# Altium project IStoreMedicinv1.PrjPcb
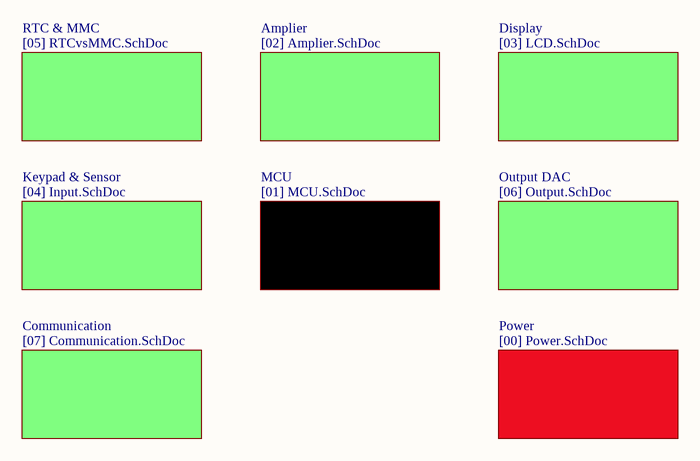
[diagram p0: IStoreMedicinv1.SchDoc]
9 sheets, 202 parts. Net scope: global (net labels, ports and power ports of the same name join across sheets).
Board file: IStoreMedicinv1.PcbDoc
Sheets:
  IStoreMedicinv1.SchDoc
    MCU = [01] MCU.SchDoc
    Amplier = [02] Amplier.SchDoc
    Display = [03] LCD.SchDoc
    Keypad & Sensor = [04] Input.SchDoc
    RTC & MMC = [05] RTCvsMMC.SchDoc
    Output DAC = [06] Output.SchDoc
    Communication = [07] Communication.SchDoc
    Power = [00] Power.SchDoc

## Sheet IStoreMedicinv1.SchDoc
size A

### Sub-sheets
Amplier = [02] Amplier.SchDoc: no entries
Communication = [07] Communication.SchDoc: no entries
Display = [03] LCD.SchDoc: no entries
Keypad & Sensor = [04] Input.SchDoc: no entries
MCU = [01] MCU.SchDoc: no entries
Output DAC = [06] Output.SchDoc: no entries
Power = [00] Power.SchDoc: no entries
RTC & MMC = [05] RTCvsMMC.SchDoc: no entries

## Sheet [01] MCU.SchDoc
size A3
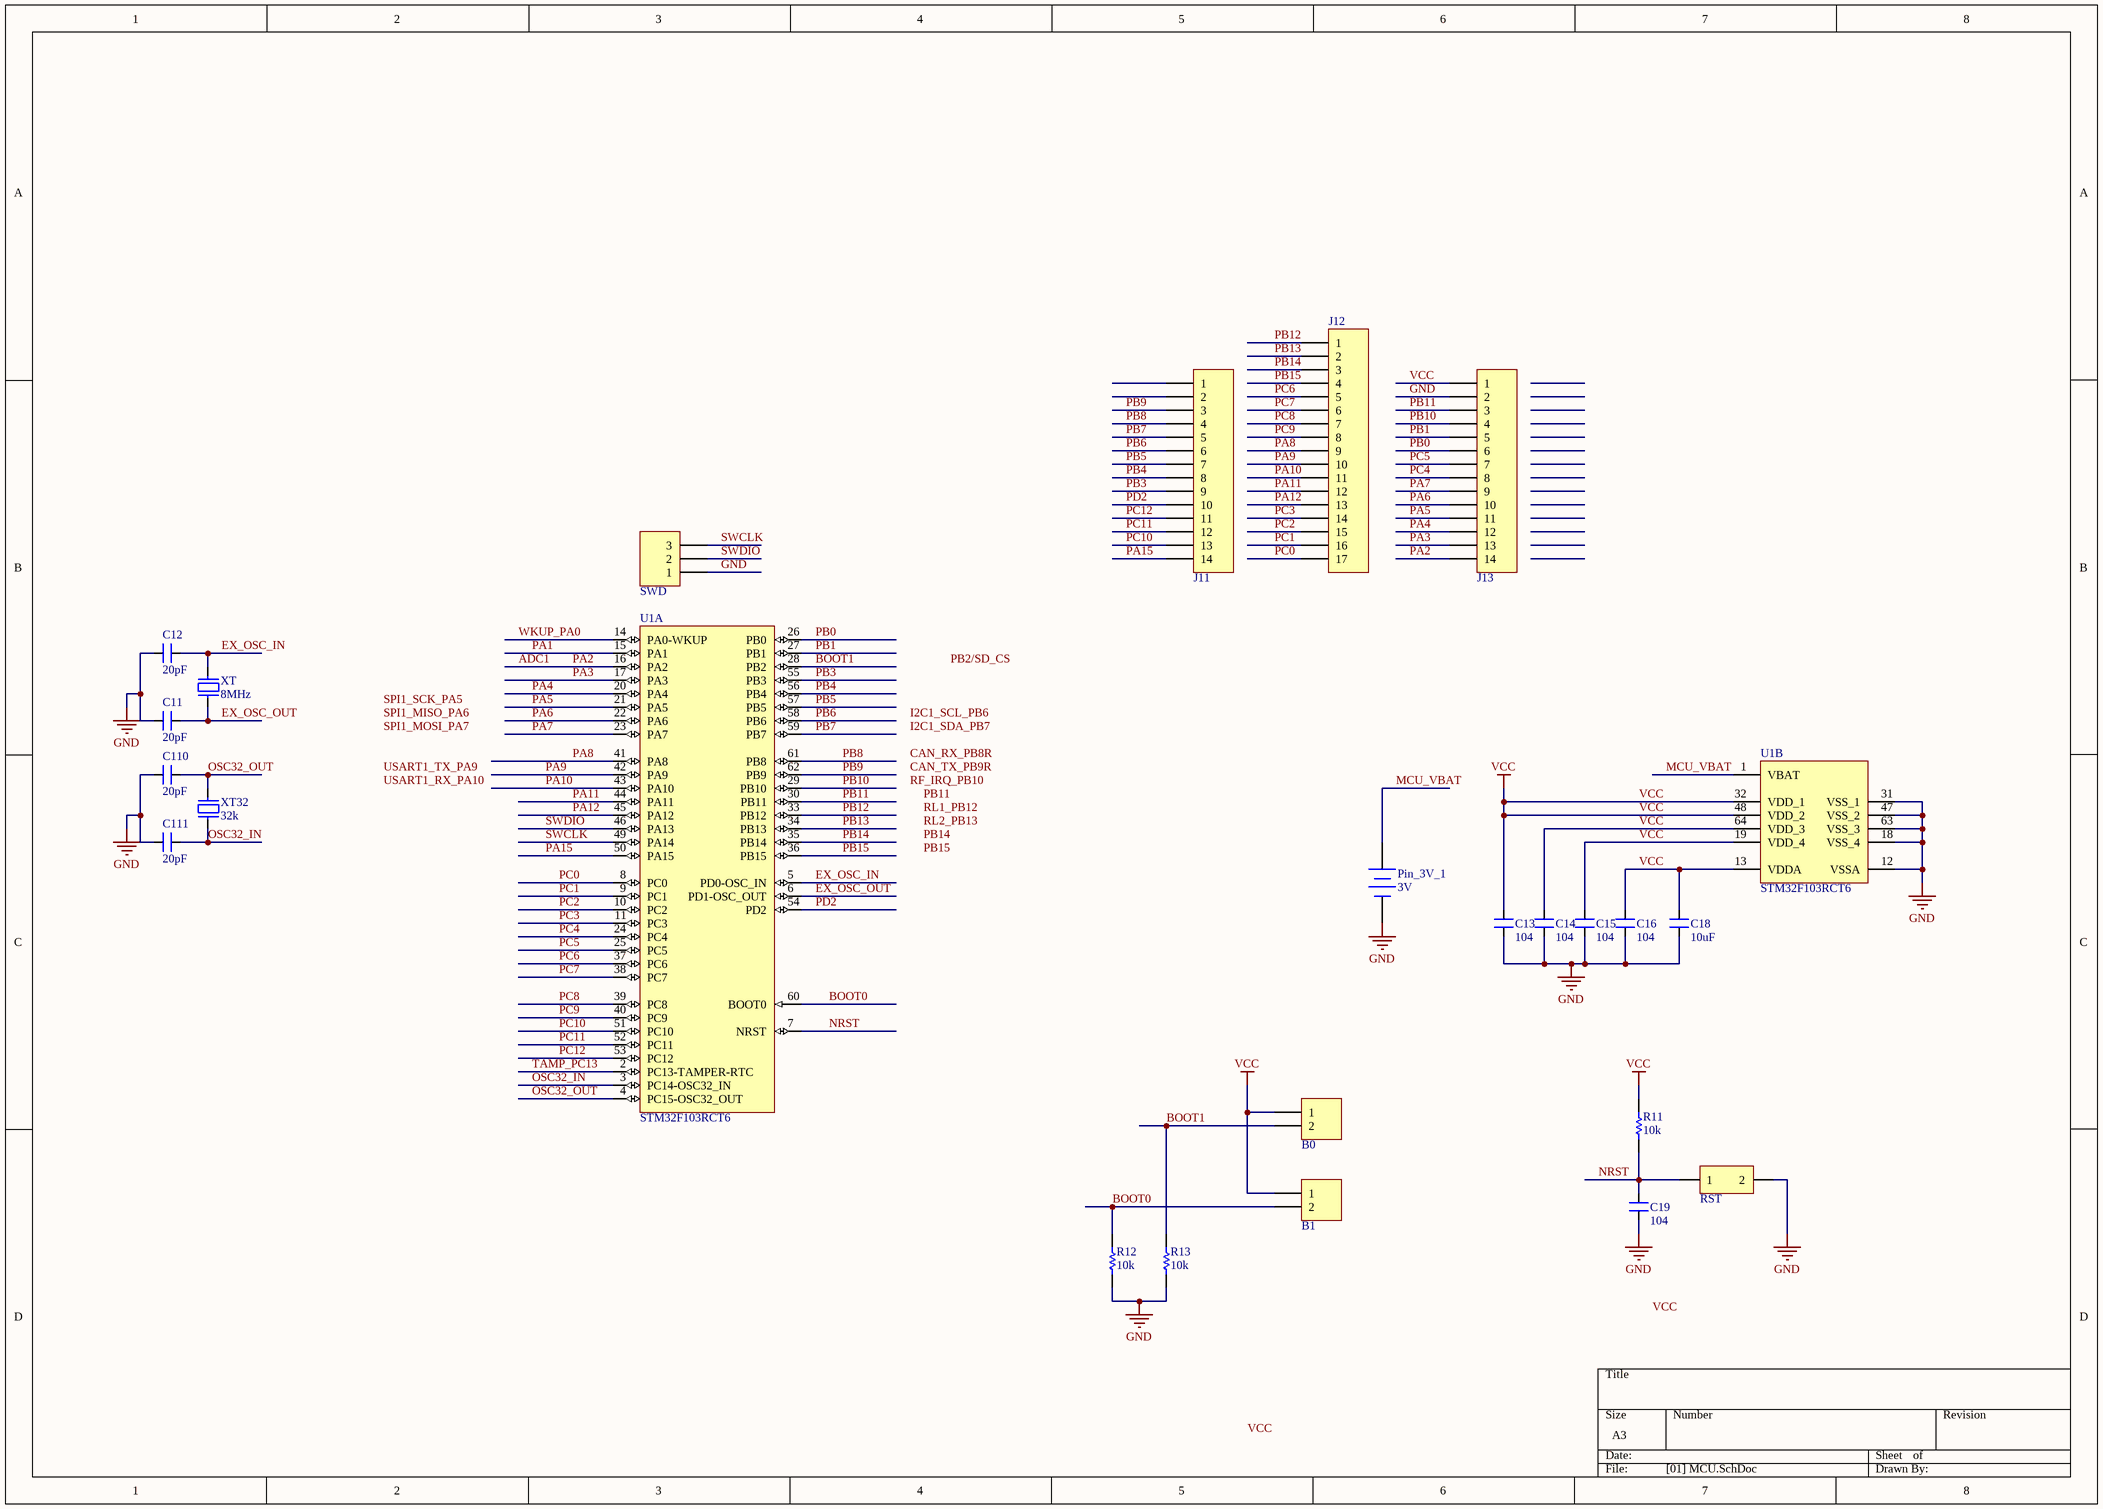
[diagram p1: [01] MCU.SchDoc]

### Parts
B0  Header 2  [HDR1X2]  (value not drawn)
B1  Header 2  [HDR1X2]  (value not drawn)
C11  value 20pF  [CAPC1608N]  (hidden comment: Cap_22p_0603)
C12  value 20pF  [CAPC1608N]  (hidden comment: Cap_22p_0603)
C13  value 104  [CAPC1608N]  (hidden comment: Cap_104_0603)
C14  value 104  [CAPC1608N]  (hidden comment: Cap_104_0603)
C15  value 104  [CAPC1608N]  (hidden comment: Cap_104_0603)
C16  value 104  [CAPC1608N]  (hidden comment: Cap_104_0603)
C18  value 10uF  [CAPC2012N_F]  (hidden comment: Cap_10uF_0805)
C19  value 104  [CAPC1608N]  (hidden comment: Cap_104_0603)
C110  value 20pF  [CAPC1608N]  (hidden comment: Cap_22p_0603)
C111  value 20pF  [CAPC1608N]  (hidden comment: Cap_22p_0603)
J11  Header 14  [HDR1X14]  (value not drawn)
J12  Header 17  [HDR1X17]  (value not drawn)
J13  Header 14  [HDR1X14]  (value not drawn)
Pin_3V_1  3V  [CR1220]
R11  value 10k  [RESC1608N_F]  (hidden comment: Res_10k_0603)
R12  value 10k  [RESC1608N_F]  (hidden comment: Res_10k_0603)
R13  value 10k  [RESC1608N_F]  (hidden comment: Res_10k_0603)
RST  Button  [SW]  (value not drawn)
SWD  Header 3  [HDR1X3]  (value not drawn)
U1  STM32F103RCT6  [STM-LQFP64_N]  (parts A,B of 2)
XT  8MHz  [XT2]
XT32  32k  [XTminiv2]

### Nets
GND: C11.2 C12.2 C13.1 C14.1 C15.1 C16.1 C18.1 C19.1 C110.2 C111.2 J13.2 Pin_3V_1.2(-) R12.1 R13.1 RST.2 SWD.1 U1.12(VSSA) U1.18(VSS_4) U1.31(VSS_1) U1.47(VSS_2) U1.63(VSS_3)
VCC: B0.1 B1.1 C13.2 C14.2 C15.2 C16.2 C18.2 J13.1 R11.2 U1.13(VDDA) U1.19(VDD_4) U1.32(VDD_1) U1.48(VDD_2) U1.64(VDD_3)
ADC1: J13.14 U1.16(PA2)  [also labelled PA2]
BOOT0: B1.2 R12.2 U1.60(BOOT0)
BOOT1: B0.2 R13.2 U1.28(PB2)
EX_OSC_IN: C12.1 U1.5(PD0-OSC_IN) XT.2
EX_OSC_OUT: C11.1 U1.6(PD1-OSC_OUT) XT.1
MCU_VBAT: Pin_3V_1.1(+) U1.1(VBAT)
NRST: C19.2 R11.1 RST.1 U1.7(NRST)
OSC32_IN: C111.1 U1.3(PC14-OSC32_IN) XT32.1
OSC32_OUT: C110.1 U1.4(PC15-OSC32_OUT) XT32.2
PA1: U1.15(PA1)
PA3: J13.13 U1.17(PA3)
PA4: J13.12 U1.20(PA4)
PA5: J13.11 U1.21(PA5)
PA6: J13.10 U1.22(PA6)
PA7: J13.9 U1.23(PA7)
PA8: J12.9 U1.41(PA8)
PA9: J12.10 U1.42(PA9)
PA10: J12.11 U1.43(PA10)
PA11: J12.12 U1.44(PA11)
PA12: J12.13 U1.45(PA12)
PA15: J11.14 U1.50(PA15)
PB0: J13.6 U1.26(PB0)
PB1: J13.5 U1.27(PB1)
PB3: J11.9 U1.55(PB3)
PB4: J11.8 U1.56(PB4)
PB5: J11.7 U1.57(PB5)
PB6: J11.6 U1.58(PB6)
PB7: J11.5 U1.59(PB7)
PB8: J11.4 U1.61(PB8)
PB9: J11.3 U1.62(PB9)
PB10: J13.4 U1.29(PB10)
PB11: J13.3 U1.30(PB11)
PB12: J12.1 U1.33(PB12)
PB13: J12.2 U1.34(PB13)
PB14: J12.3 U1.35(PB14)
PB15: J12.4 U1.36(PB15)
PC0: J12.17 U1.8(PC0)
PC1: J12.16 U1.9(PC1)
PC2: J12.15 U1.10(PC2)
PC3: J12.14 U1.11(PC3)
PC4: J13.8 U1.24(PC4)
PC5: J13.7 U1.25(PC5)
PC6: J12.5 U1.37(PC6)
PC7: J12.6 U1.38(PC7)
PC8: J12.7 U1.39(PC8)
PC9: J12.8 U1.40(PC9)
PC10: J11.13 U1.51(PC10)
PC11: J11.12 U1.52(PC11)
PC12: J11.11 U1.53(PC12)
PD2: J11.10 U1.54(PD2)
SWCLK: SWD.3 U1.49(PA14)
SWDIO: SWD.2 U1.46(PA13)
TAMP_PC13: U1.2(PC13-TAMPER-RTC)
WKUP_PA0: U1.14(PA0-WKUP)

Not connected (* = marked no-connect by the designer): J11 1 2

### Notes on the sheet
- Labels drawn without touching a wire or pin: CAN_RX_PB8R, CAN_TX_PB9R, I2C1_SCL_PB6, I2C1_SDA_PB7, PB2/SD_CS, PB11, PB14, PB15, RF_IRQ_PB10, RL1_PB12, RL2_PB13, SPI1_MISO_PA6, SPI1_MOSI_PA7, SPI1_SCK_PA5, USART1_RX_PA10, USART1_TX_PA9, VCC

### Library data of the parts
B0 B1 = Header 2: Header, 2-Pin; LatestRevisionDate: 17-Jul-2002; LatestRevisionNote: Re-released for DXP Platform.; Publisher: Altium Limited
C11-C16 C18 C19 C110 C111 = CAP NP
J11 J13 = Header 14: Header, 14-Pin; LatestRevisionDate: 17-Jul-2002; LatestRevisionNote: Re-released for DXP Platform.; Publisher: Altium Limited
J12 = Header 17: Header, 17-Pin; LatestRevisionDate: 17-Jul-2002; LatestRevisionNote: Re-released for DXP Platform.; Publisher: Altium Limited
Pin_3V_1 = Battery: Multicell Battery; Published: 24-Mar-1999; LatestRevisionDate: 17-Jul-2002; LatestRevisionNote: Re-released for DXP Platform.; PackageReference: BAT-2; Publisher: Altium Limited
R11-R13 = Res
RST = Button I
SWD = Header 3: Header, 3-Pin; LatestRevisionDate: 17-Jul-2002; LatestRevisionNote: Re-released for DXP Platform.; Publisher: Altium Limited
U1 = STM32F103RCT6: ARM Cortex-M3 32-bit MCU, 256 KB Flash, 48 KB Internal RAM, 51 I/Os, 64-pin LQFP, -40 to 85 degC, Tray; A/D Converter: 3x12-bit (16 Channel); D/A Converter: 2x12-bit (2 Channel); FLASH Size (Prog) (kB): 256; I/Os (High Current): 51; Internal RAM Size (kB): 48; Operating Frequency(F) (Processor speed) (MHz): 72; Supply Voltage(Vcc) min (V): 2; DatasheetVersion: Rev. 8; PackageVersion: Rev. 4, 06/2013; PackageReference: LQFP64; PackageDescription: 64-Pin Low Profile Quad Flat Package, 10 x 10 mm Body, 0.5 mm Pitch; Supplier 1: Digi-Key; Supplier Part Number 1: 497-9033-ND; Supplier 2: Newark; Supplier Part Number 2: 01P4099; Supplier 3: Newark; Supplier Part Number 3: 57P1227; Supplier 4: Mouser; Supplier Part Number 4: 511-STM32F103RCT6; Core: ARM Cortex-M3; Packing: Tray; Mounting Technology: Surface Mount; PartNumber: STM32F103RCT6; ComponentLink1Description: Manufacturer URL; ComponentLink1URL: http://www.st.com/web/en/home.html; ComponentLink2Description: Datasheet; ComponentLink2URL: http://www.st.com/st-web-ui/static/active/en/resource/technical/document/datasheet/CD00191185.pdf; ComponentLink3Description: Package Specification; ComponentLink3URL: http://www.st.com/st-web-ui/static/active/en/resource/technical/document/datasheet/DM00037051.pdf
XT XT32 = Crystal

## Sheet [02] Amplier.SchDoc
size A
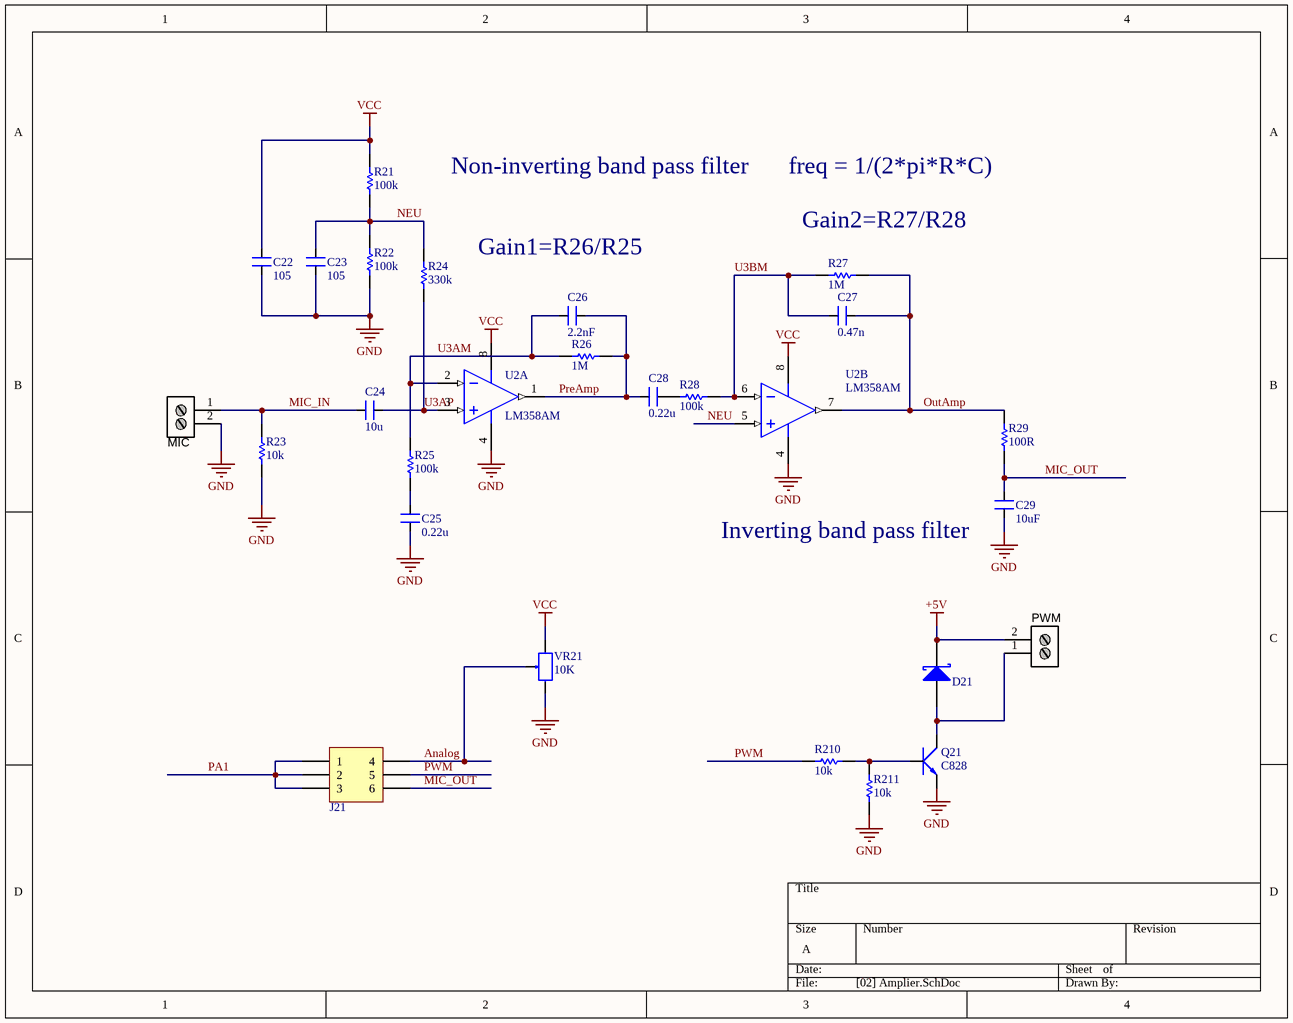
[diagram p2: [02] Amplier.SchDoc]

### Parts
C22  value 105  [CAPC2012N_F]  (hidden comment: CAP NP)
C23  value 105  [CAPC2012N_F]  (hidden comment: CAP NP)
C24  value 10u  [CAPC2012N_F]  (hidden comment: CAP NP)
C25  value 0.22u  [CAPC2012N_F]  (hidden comment: CAP NP)
C26  value 2.2nF  [CAPC2012N_F]  (hidden comment: CAP NP)
C27  value 0.47n  [CAPC2012N_F]  (hidden comment: CAP NP)
C28  value 0.22u  [CAPC2012N_F]  (hidden comment: CAP NP)
C29  value 10uF  [CAPC2012N_F]  (hidden comment: CAP NP)
D21  Diode  [DO-214AC]  (value not drawn)
J21  Header 3X2A  [HDR2X3_CEN]  (value not drawn)
MIC  Stackable ScrewTerm  [2P_PCB_ScrewTerm_200mil]  (value not drawn)
PWM  Stackable ScrewTerm  [2P_PCB_ScrewTerm_200mil]  (value not drawn)
Q21  C828  [SOT23 TOP]
R21  value 100k  [RESC2012N_F]  (hidden comment: Res)
R22  value 100k  [RESC2012N_F]  (hidden comment: Res)
R23  value 10k  [RESC2012N_F]  (hidden comment: Res)
R24  value 330k  [RESC2012N_F]  (hidden comment: Res)
R25  value 100k  [RESC2012N_F]  (hidden comment: Res)
R26  value 1M  [RESC2012N_F]  (hidden comment: Res)
R27  value 1M  [RESC2012N_F]  (hidden comment: Res)
R28  value 100k  [RESC2012N_F]  (hidden comment: Res)
R29  value 100R  [RESC2012N_F]  (hidden comment: Res)
R210  value 10k  [RESC1608N_ZERO]  (hidden comment: Res)
R211  value 10k  [RESC1608N_ZERO]  (hidden comment: Res)
U2  LM358AM  [M08A_N]  (parts A,B of 2)
VR21  10K  [VR1]

### Nets
+5V: D21.2(K) PWM.2
GND: C22.1 C23.1 C25.1 C29.2 MIC.2 Q21.3(E) R22.1 R23.2 R211.1 U2.4(GND) VR21.1
VCC: C22.2 R21.2 U2.8(V+) VR21.3
Analog: J21.4 VR21.2
MIC_IN: C24.2 MIC.1 R23.1
MIC_OUT: C29.1 J21.6 R29.1
NEU: C23.2 R21.1 R22.2 R24.1 U2.5(INB+)
OutAmp: C27.1 R27.1 R29.2 U2.7(OUTB)
PA1: J21.1 J21.2 J21.3
PreAmp: C26.1 C28.2 R26.1 U2.1(OUTA)
PWM: J21.5 R210.1
U3AM: C26.2 R25.1 R26.2 U2.2(INA-)
U3AP: C24.1 R24.2 U2.3(INA+)
U3BM: C27.2 R27.2 R28.2 U2.6(INB-)
NetC25_2: C25.2 R25.2
NetC28_1: C28.1 R28.1
NetD21_1: D21.1(A) PWM.1 Q21.2(C)
NetQ21_1: Q21.1(B) R210.2 R211.2

### Notes on the sheet
- Non-inverting band pass filter
- freq = 1/(2*pi*R*C)
- (near R27) Gain2=R27/R28
- Gain1=R26/R25
- (near C29) Inverting band pass filter

### Library data of the parts
D21 = Diode: pin to pad: 1>A 2>K
J21 = Header 3X2A: Header, 3-Pin, Dual row; LatestRevisionDate: 17-Jul-2002; LatestRevisionNote: Re-released for DXP Platform.; Publisher: Altium Limited
MIC PWM = 2P_ScrewTerm_90S_3.81MM: Terminal Block Screw Type THT 2-Position 3.81mm pitch; Manufacturer 1: Tyco Electronics; Manufacturer Part Number 1: 1776113-2; Value: 2 position; Pitch: 0.150" (3.81mm); Positions Per Level: 2; Package / Case: Side Entry; 3.81mm pitch; Category: Connectors Interconnects; Color: Black; Supplier 1: Digi-Key; Supplier Part Number 1: A97976-ND
Q21 = NPN: Transistor C828 C1815....
U2 = LM358AM: Low Power Dual Operational Amplifier; Manufacturer: National Semiconductor; CompType: Amplifiers; PackageTopMarking: NSZXTT*LM*358AM; PowerWise: N; Published: 4-Dec-2008; LatestRevisionDate: 13-Jan-2009; LatestRevisionNote: Sim Model Added.; DatasheetVersion: Oct-2005; PackageVersion: revL, Sep-2006; PackageReference: M08A; Publisher: Altium Limited; PackageDescription: SOIC Narrow, 4.9 x 3.9 x 1.45mm, 8 Lead, 1.27mm Pitch; PartNumber: LM358AM; RoHS: O; PinCount: 8; DigiKeyPartNumber: LM358AMXCT-ND; Code_JEDEC: MS-012-AA; Code_IPC: SOIC127P600-8; ComponentLink1Description: LM358 Datasheet; ComponentLink1URL: http://www.national.com/ds/LM/LM358.pdf; ComponentLink2Description: LM358 Web Page; ComponentLink2URL: http://www.national.com/pf/LM/LM358.html; ComponentLink3Description: M08A Package Page; ComponentLink3URL: http://www.national.com/packaging/folders/m08a.html
VR21 = VR: Var Resistor; Value: VR 10K

## Sheet [03] LCD.SchDoc
size A
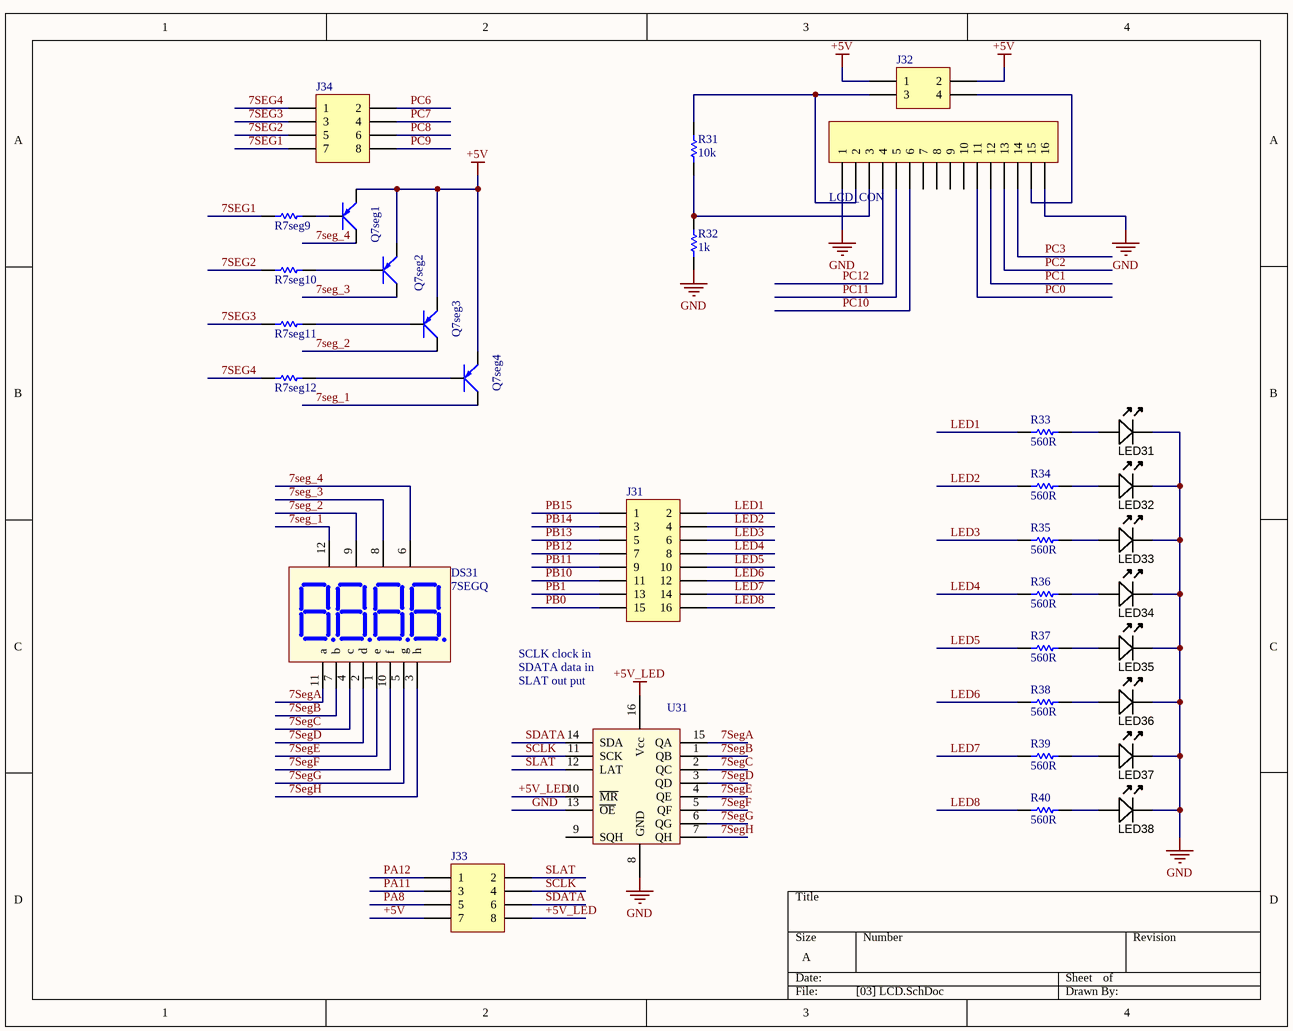
[diagram p3: [03] LCD.SchDoc]

### Parts
DS31  7SEGQ  [7segx4_small]
J31  Header 8X2  [HDR2X8]  (value not drawn)
J32  Header 2X2  [HDR2X2]  (value not drawn)
J33  Header 4X2  [HDR2X4]  (value not drawn)
J34  Header 4X2  [HDR2X4]  (value not drawn)
LCD_CON  Header 16  [HDR1X16]  (value not drawn)
LED31  Blue  [LED-0805-K]  (value not drawn)
LED32  Blue  [LED-0805-K]  (value not drawn)
LED33  Blue  [LED-0805-K]  (value not drawn)
LED34  Blue  [LED-0805-K]  (value not drawn)
LED35  Blue  [LED-0805-K]  (value not drawn)
LED36  Blue  [LED-0805-K]  (value not drawn)
LED37  Blue  [LED-0805-K]  (value not drawn)
LED38  Blue  [LED-0805-K]  (value not drawn)
Q7seg1  A1015  [SOT23B]  (value not drawn)
Q7seg2  A1015  [SOT23B]  (value not drawn)
Q7seg3  A1015  [SOT23B]  (value not drawn)
Q7seg4  A1015  [SOT23B]  (value not drawn)
R7seg9  Res  [RESC1608N_ZERO]  (value not drawn)
R7seg10  Res  [RESC1608N_ZERO]  (value not drawn)
R7seg11  Res  [RESC1608N_ZERO]  (value not drawn)
R7seg12  Res  [RESC1608N_ZERO]  (value not drawn)
R31  value 10k  [RESC1608N_ZERO]  (hidden comment: Res)
R32  value 1k  [RESC1608N_ZERO]  (hidden comment: Res)
R33  value 560R  [RESC1608N_ZERO]  (hidden comment: Res)
R34  value 560R  [RESC1608N_ZERO]  (hidden comment: Res)
R35  value 560R  [RESC1608N_ZERO]  (hidden comment: Res)
R36  value 560R  [RESC1608N_ZERO]  (hidden comment: Res)
R37  value 560R  [RESC1608N_ZERO]  (hidden comment: Res)
R38  value 560R  [RESC1608N_ZERO]  (hidden comment: Res)
R39  value 560R  [RESC1608N_ZERO]  (hidden comment: Res)
R40  value 560R  [RESC1608N_ZERO]  (hidden comment: Res)
U31  74HC595  [SOIC16]  (value not drawn)

### Nets
+5V: J32.1 J32.2 J33.7 Q7seg1.1(E) Q7seg2.1(E) Q7seg3.1(E) Q7seg4.1(E)
+5V_LED: J33.8 U31.10(~{MR}) U31.16(Vcc)
GND: LCD_CON.1 LCD_CON.16 LED31.K LED32.K LED33.K LED34.K LED35.K LED36.K LED37.K LED38.K R32.1 U31.8(GND) U31.13(~{OE})
7SEG1: J34.7 R7seg9.1
7SEG2: J34.5 R7seg10.1
7SEG3: J34.3 R7seg11.1
7SEG4: J34.1 R7seg12.1
7seg_1: DS31.12(V1) Q7seg4.2(C)
7seg_2: DS31.9(V2) Q7seg3.2(C)
7seg_3: DS31.8(V3) Q7seg2.2(C)
7seg_4: DS31.6(V4) Q7seg1.2(C)
7SegA: DS31.11(a) U31.15(QA)
7SegB: DS31.7(b) U31.1(QB)
7SegC: DS31.4(c) U31.2(QC)
7SegD: DS31.2(d) U31.3(QD)
7SegE: DS31.1(e) U31.4(QE)
7SegF: DS31.10(f) U31.5(QF)
7SegG: DS31.5(g) U31.6(QG)
7SegH: DS31.3(h) U31.7(QH)
LED1: J31.2 R33.1
LED2: J31.4 R34.1
LED3: J31.6 R35.1
LED4: J31.8 R36.1
LED5: J31.10 R37.1
LED6: J31.12 R38.1
LED7: J31.14 R39.1
LED8: J31.16 R40.1
PA8: J33.5
PA11: J33.3
PA12: J33.1
PB0: J31.15
PB1: J31.13
PB10: J31.11
PB11: J31.9
PB12: J31.7
PB13: J31.5
PB14: J31.3
PB15: J31.1
PC0: LCD_CON.11
PC1: LCD_CON.12
PC2: LCD_CON.13
PC3: LCD_CON.14
PC6: J34.2
PC7: J34.4
PC8: J34.6
PC9: J34.8
PC10: LCD_CON.6
PC11: LCD_CON.5
PC12: LCD_CON.4
SCLK: J33.4 U31.11(SCK)
SDATA: J33.6 U31.14(SDA)
SLAT: J33.2 U31.12(LAT)
NetJ32_3: J32.3 LCD_CON.2 R31.2
NetJ32_4: J32.4 LCD_CON.15
NetLCD_CON_3: LCD_CON.3 R31.1 R32.2
NetLED31_A: LED31.A R33.2
NetLED32_A: LED32.A R34.2
NetLED33_A: LED33.A R35.2
NetLED34_A: LED34.A R36.2
NetLED35_A: LED35.A R37.2
NetLED36_A: LED36.A R38.2
NetLED37_A: LED37.A R39.2
NetLED38_A: LED38.A R40.2
NetQ7seg1_3: Q7seg1.3(B) R7seg9.2
NetQ7seg2_3: Q7seg2.3(B) R7seg10.2
NetQ7seg3_3: Q7seg3.3(B) R7seg11.2
NetQ7seg4_3: Q7seg4.3(B) R7seg12.2

Not connected (* = marked no-connect by the designer): LCD_CON 7 8 9 10; U31 9(SQH)

### Notes on the sheet
- SCLK clock in
- SDATA data in
- (near U31) SLAT out put

### Library data of the parts
DS31 = LED7Q: Four 7 Seg Dipslay; Value: LED 7Q SEG
J31 = Header 8X2: Header, 8-Pin, Dual row; LatestRevisionDate: 17-Jul-2002; LatestRevisionNote: Re-released for DXP Platform.; Publisher: Altium Limited
J32 = Header 2X2: Header, 2-Pin, Dual row; LatestRevisionDate: 17-Jul-2002; LatestRevisionNote: Re-released for DXP Platform.; Publisher: Altium Limited
J33 J34 = Header 4X2: Header, 4-Pin, Dual row; LatestRevisionDate: 17-Jul-2002; LatestRevisionNote: Re-released for DXP Platform.; Publisher: Altium Limited
LCD_CON = Header 16: Header, 16-Pin; LatestRevisionDate: 17-Jul-2002; LatestRevisionNote: Re-released for DXP Platform.; Publisher: Altium Limited
LED31-LED38 = LED_SMD_Blue_0805_100mcd: LED 0805 SMD Blue 100mcd 470nm; Manufacturer 1: Ligitek; Manufacturer Part Number 1: LG-170DBKZ-CT; Material: InGaN/GaN; Ratings: 100 mcd; 470 nm; Package / Case: 0805; Value: Blue; Color: Blue
Q7seg1-Q7seg4 = A1015: PNP 600mW, ECB; Value: A1015
R7seg9 = Res: Value: 1K
R7seg10-R7seg12 = Res: Value: 220R

## Sheet [04] Input.SchDoc
size A
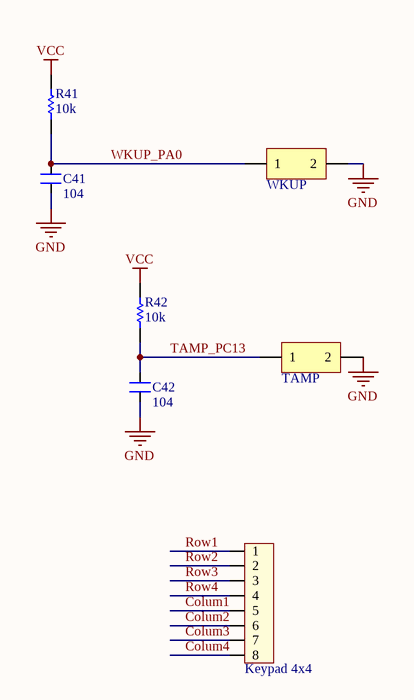
[diagram p4: [04] Input.SchDoc]

### Parts
C41  value 104  [CAPC1608N]  (hidden comment: CAP NP)
C42  value 104  [CAPC1608N]  (hidden comment: CAP NP)
Keypad_4x4  JP8  [CON8]  (value not drawn)
R41  value 10k  [RESC1608N_ZERO]  (hidden comment: Res)
R42  value 10k  [RESC1608N_ZERO]  (hidden comment: Res)
TAMP  Button  [SW]  (value not drawn)
WKUP  Button  [SW]  (value not drawn)

### Nets
GND: C41.1 C42.1 TAMP.2 WKUP.2
VCC: R41.2 R42.2
Colum1: Keypad_4x4.5
Colum2: Keypad_4x4.6
Colum3: Keypad_4x4.7
Colum4: Keypad_4x4.8
Row1: Keypad_4x4.1
Row2: Keypad_4x4.2
Row3: Keypad_4x4.3
Row4: Keypad_4x4.4
TAMP_PC13: C42.2 R42.1 TAMP.1
WKUP_PA0: C41.2 R41.1 WKUP.1

### Library data of the parts
Keypad_4x4 = Con8: Connector 8; Value: Connector 8
TAMP WKUP = Button I

## Sheet [05] RTCvsMMC.SchDoc
size A
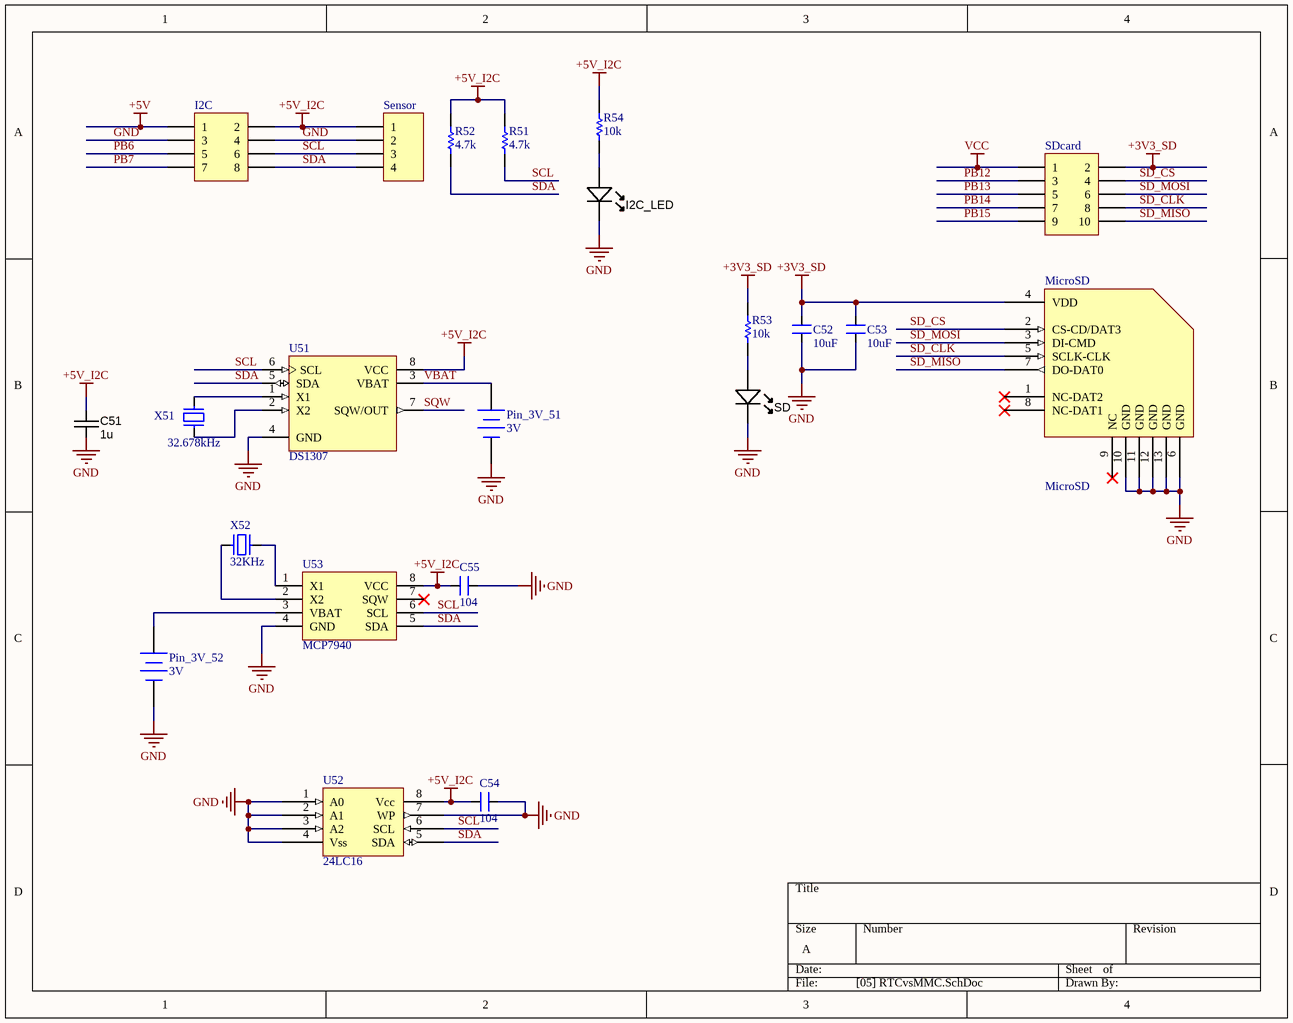
[diagram p5: [05] RTCvsMMC.SchDoc]

### Parts
C51  value 1u  [CAPC1608N]  (hidden comment: approved sub OK)
C52  value 10uF  [CAPC2012N_F]  (hidden comment: CAP NP)
C53  value 10uF  [CAPC2012N_F]  (hidden comment: CAP NP)
C54  value 104  [CAPC2012N_F]  (hidden comment: CAP NP)
C55  value 104  [CAPC2012N_F]  (hidden comment: CAP NP)
I2C  Header 4X2  [HDR2X4]  (value not drawn)
I2C_LED  Green  [LED-0805-K]  (value not drawn)
MicroSD  MicroSD  [microsd]
Pin_3V_51  3V  [CR1220]
Pin_3V_52  3V  [CR1220]
R51  value 4.7k  [RESC1608N_ZERO]  (hidden comment: Res)
R52  value 4.7k  [RESC1608N_ZERO]  (hidden comment: Res)
R53  value 10k  [RESC1608N_ZERO]  (hidden comment: Res)
R54  value 10k  [RESC1608N_ZERO]  (hidden comment: Res)
SD  Green  [LED-0805-K]  (value not drawn)
SDcard  Header 5X2  [HDR2X5]  (value not drawn)
Sensor  Header 4  [HDR1X4]  (value not drawn)
U51  DS1307  [SOIC127P600X175-8AN]
U52  24LC16  [SOIC-8]
U53  MCP7940  [SOIC-8]
X51  32.678kHz  [XTminiv2]
X52  32KHz  [XTminiv2]

### Nets
+3V3_SD: C52.2 C53.2 MicroSD.4(VDD) R53.2 SDcard.2
+5V: I2C.1
+5V_I2C: C51.1 C54.1 C55.1 I2C.2 R51.2 R52.2 R54.2 Sensor.1 U51.8(VCC) U52.8(Vcc) U53.8(VCC)
GND: C51.2 C52.1 C53.1 C54.2 C55.2 I2C.3 I2C.4 I2C_LED.K MicroSD.6(GND) MicroSD.10(GND) MicroSD.11(GND) MicroSD.12(GND) MicroSD.13(GND) Pin_3V_51.2(-) Pin_3V_52.2(-) SD.K Sensor.2 U51.4(GND) U52.1(A0) U52.2(A1) U52.3(A2) U52.4(Vss) U52.7(WP) U53.4(GND)
VCC: SDcard.1
PB6: I2C.5
PB7: I2C.7
PB12: SDcard.3
PB13: SDcard.5
PB14: SDcard.7
PB15: SDcard.9
SCL: I2C.6 R51.1 Sensor.3 U51.6(SCL) U52.6(SCL) U53.6(SCL)
SD_CLK: MicroSD.5(SCLK-CLK) SDcard.8
SD_CS: MicroSD.2(CS-CD/DAT3) SDcard.4
SD_MISO: MicroSD.7(DO-DAT0) SDcard.10
SD_MOSI: MicroSD.3(DI-CMD) SDcard.6
SDA: I2C.8 R52.1 Sensor.4 U51.5(SDA) U52.5(SDA) U53.5(SDA)
SQW: U51.7(SQW/OUT)
VBAT: Pin_3V_51.1(+) U51.3(VBAT)
NetI2C_LED_A: I2C_LED.A R54.1
NetPin_3V_52_1: Pin_3V_52.1(+) U53.3(VBAT)
NetR53_1: R53.1 SD.A
NetU51_1: U51.1(X1) X51.1
NetU51_2: U51.2(X2) X51.2
NetU53_1: U53.1(X1) X52.1
NetU53_2: U53.2(X2) X52.2

Not connected (* = marked no-connect by the designer): MicroSD 1(NC-DAT2)* 8(NC-DAT1)* 9(NC)*; U53 7(SQW)*

### Library data of the parts
C51 = CAPC_1n_0603_100V: Capacitor SMD Cer 1nF 10% 100V X7R 0603; Manufacturer 1: Murata Electronics North America; Manufacturer Part Number 1: GCM188R72A102KA37D; Ratings: 100V; X7R; Material: ceramic; Package / Case: 0603 (1608 metric); Tolerance: ±10%; Supplier 1: Digi-Key; Supplier Part Number 1: 490-4780-1-ND; Operating Temperature: -55°C ~ 125°C; Size / Dimension: 0.063" L x 0.031" W (1.60mm x 0.80mm); Thickness (Max): 0.035" (0.90mm); ComponentLink1URL: http://search.murata.co.jp/Ceramy/image/img/PDF/ENG/GCM188R72A102KA37.pdf; ComponentLink1Description: http://search.murata.co.jp/Ceramy/image/img/PDF/ENG/GCM188R72A102KA37.pdf
I2C = Header 4X2: Header, 4-Pin, Dual row; LatestRevisionDate: 17-Jul-2002; LatestRevisionNote: Re-released for DXP Platform.; Publisher: Altium Limited
I2C_LED SD = LED_SMD_Green_0805: LED, 0805 SMD, Green; Manufacturer 1: Ligitek; Manufacturer Part Number 1: LG170G-CT; Ratings: 10 mcd; 573 nm; Package / Case: 0805; Material: GaP
Pin_3V_51 Pin_3V_52 = Battery: Multicell Battery; Published: 24-Mar-1999; LatestRevisionDate: 17-Jul-2002; LatestRevisionNote: Re-released for DXP Platform.; PackageReference: BAT-2; Publisher: Altium Limited
SDcard = Header 5X2: Header, 5-Pin, Dual row; LatestRevisionDate: 17-Jul-2002; LatestRevisionNote: Re-released for DXP Platform.; Publisher: Altium Limited
Sensor = Header 4: Header, 4-Pin; LatestRevisionDate: 17-Jul-2002; LatestRevisionNote: Re-released for DXP Platform.; Publisher: Altium Limited
U52 = 24LC04B
U53 = DS1307: Real Timer Serial; Value: DS1307
X51 = Crystal
X52 = XT2: Crystal For all Crystal 2pin.; Value: 4Mhz

## Sheet [06] Output.SchDoc
size A
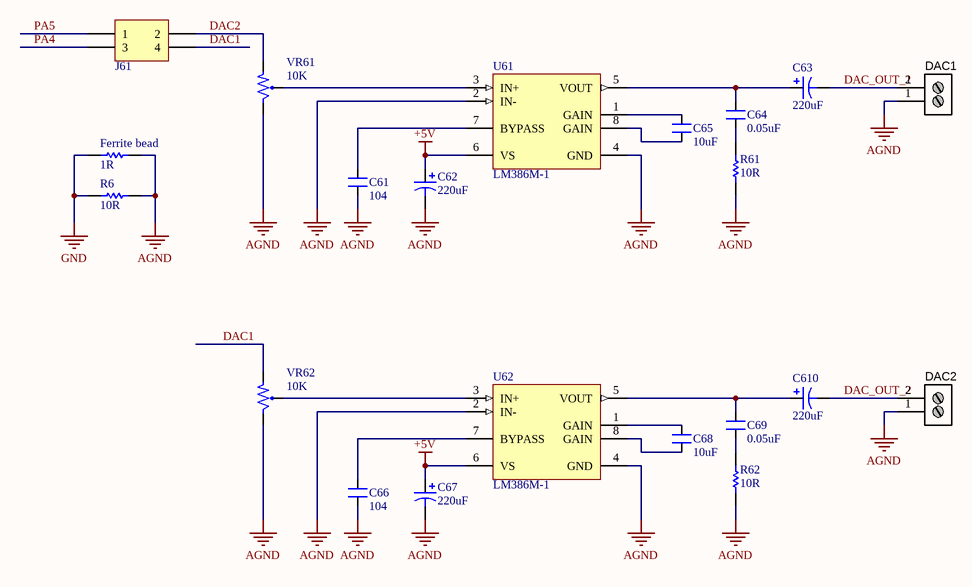
[diagram p6: [06] Output.SchDoc]

### Parts
C61  value 104  [CAPC1608N]  (hidden comment: CAP NP)
C62  value 220uF  [CAP 3.8mm]  (hidden comment: Cap)
C63  value 220uF  [CAP 3.8mm]  (hidden comment: Cap)
C64  value 0.05uF  [CAPC2012N_F]  (hidden comment: CAP NP)
C65  value 10uF  [CAPC2012N_F]  (hidden comment: CAP NP)
C66  value 104  [CAPC1608N]  (hidden comment: CAP NP)
C67  value 220uF  [CAP 3.8mm]  (hidden comment: Cap)
C68  value 10uF  [CAPC2012N_F]  (hidden comment: CAP NP)
C69  value 0.05uF  [CAPC2012N_F]  (hidden comment: CAP NP)
C610  value 220uF  [CAP 3.8mm]  (hidden comment: Cap)
DAC1  Stackable ScrewTerm  [2P_PCB_ScrewTerm_200mil]  (value not drawn)
DAC2  Stackable ScrewTerm  [2P_PCB_ScrewTerm_200mil]  (value not drawn)
Ferrite_bead  value 1R  [RESTH_0.0R_AXIAL-0.6]  (hidden comment: Res)
J61  Header 2X2  [HDR2X2]  (value not drawn)
R6  value 10R  [RESTH_0.0R_AXIAL-0.6]  (hidden comment: Res)
R61  value 10R  [RESC2012N_F]  (hidden comment: Res)
R62  value 10R  [RESC2012N_F]  (hidden comment: Res)
U61  LM386M-1  [M08A_N]
U62  LM386M-1  [M08A_N]
VR61  10K  [VR1]
VR62  10K  [VR1]

### Nets
+5V: C62.1 C67.1 U61.6(VS) U62.6(VS)
AGND: C61.1 C62.2 C66.1 C67.2 DAC1.1 DAC2.1 Ferrite_bead.2 R6.2 R61.1 R62.1 U61.2(IN-) U61.4(GND) U62.2(IN-) U62.4(GND) VR61.3 VR62.3
GND: Ferrite_bead.1 R6.1
DAC1: J61.4 VR62.1
DAC2: J61.2 VR61.1
DAC_OUT_1: C63.2 DAC1.2
DAC_OUT_2: C610.2 DAC2.2
PA4: J61.3
PA5: J61.1
NetC61_2: C61.2 U61.7(BYPASS)
NetC63_1: C63.1 C64.1 U61.5(VOUT)
NetC64_2: C64.2 R61.2
NetC65_1: C65.1 U61.8(GAIN)
NetC65_2: C65.2 U61.1(GAIN)
NetC66_2: C66.2 U62.7(BYPASS)
NetC68_1: C68.1 U62.8(GAIN)
NetC68_2: C68.2 U62.1(GAIN)
NetC69_1: C69.1 C610.1 U62.5(VOUT)
NetC69_2: C69.2 R62.2
NetU61_3: U61.3(IN+) VR61.2
NetU62_3: U62.3(IN+) VR62.2

### Library data of the parts
DAC1 DAC2 = 2P_ScrewTerm_90S_3.81MM: as MIC on sheet [02] Amplier; Package / Case: Side Entry; 3.81mm pitch; Category: Connectors Interconnects; Color: Black; Supplier 1: Digi-Key; Supplier Part Number 1: A97976-ND
J61 = Header 2X2: Header, 2-Pin, Dual row; LatestRevisionDate: 17-Jul-2002; LatestRevisionNote: Re-released for DXP Platform.; Publisher: Altium Limited
U61 U62 = LM386M-1: Low Voltage Audio Power Amplifier; Manufacturer: National Semiconductor; CompType: Audio IC; PackageTopMarking: NSZXTT*LM386*M-1; PowerWise: N; Published: 4-Dec-2008; DatasheetVersion: Aug-2000; PackageVersion: revL, Sep-2006; PackageReference: M08A; Publisher: Altium Limited; PackageDescription: SOIC Narrow, 4.9 x 3.9 x 1.45mm, 8 Lead, 1.27mm Pitch; PartNumber: LM386M-1; RoHS: O; PinCount: 8; DigiKeyPartNumber: LM386M-1-ND; Code_JEDEC: MS-012-AA; Code_IPC: SOIC127P600-8; ComponentLink1Description: LM386 Datasheet; ComponentLink1URL: http://www.national.com/ds/LM/LM386.pdf; ComponentLink2Description: LM386 Web Page; ComponentLink2URL: http://www.national.com/pf/LM/LM386.html; ComponentLink3Description: M08A Package Page; ComponentLink3URL: http://www.national.com/packaging/folders/m08a.html
VR61 VR62 = VR1: Var Resistor; Value: VR 10K

## Sheet [07] Communication.SchDoc
size A3
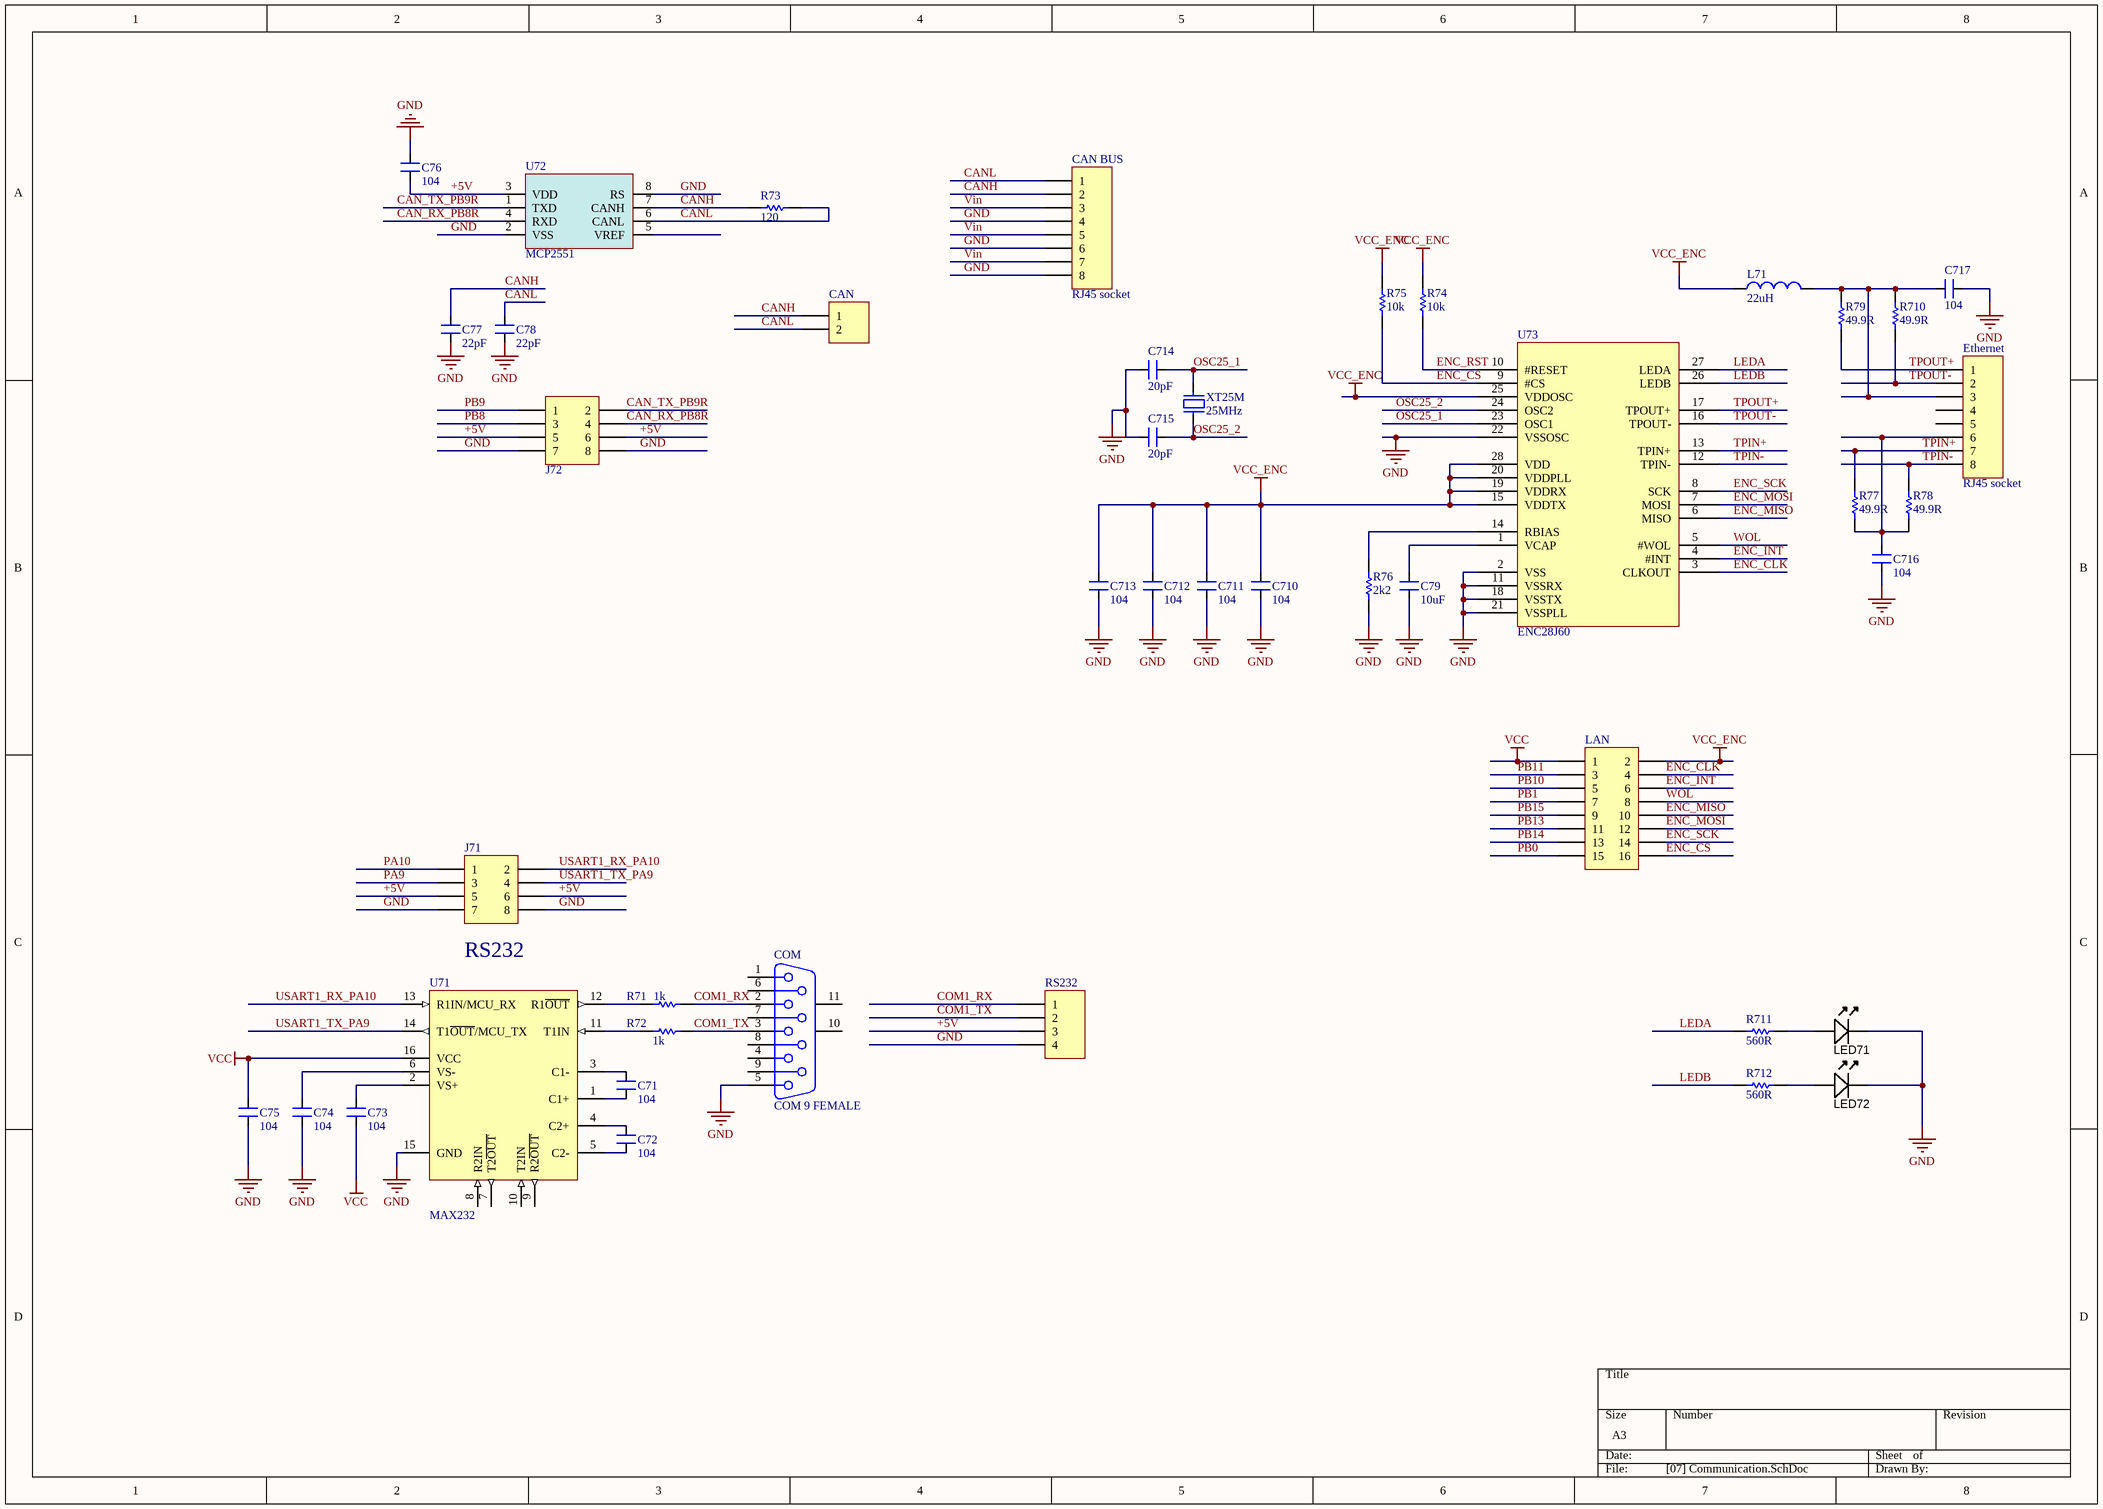
[diagram p7: [07] Communication.SchDoc]

### Parts
C71  value 104  [CAPC2012N_F]  (hidden comment: Cap_1206_104)
C72  value 104  [CAPC2012N_F]  (hidden comment: Cap_1206_104)
C73  value 104  [CAPC2012N_F]  (hidden comment: Cap_1206_104)
C74  value 104  [CAPC2012N_F]  (hidden comment: Cap_1206_104)
C75  value 104  [CAPC2012N_F]  (hidden comment: Cap_1206_104)
C76  value 104  [CAPC2012N_F]  (hidden comment: Cap_10uF_0805)
C77  value 22pF  [CAPC1608N]  (hidden comment: Cap_22p_0603)
C78  value 22pF  [CAPC1608N]  (hidden comment: Cap_22p_0603)
C79  value 10uF  [CAPC2012N_F]  (hidden comment: CAP NP)
C710  value 104  [CAPC1608N]  (hidden comment: CAP NP)
C711  value 104  [CAPC1608N]  (hidden comment: CAP NP)
C712  value 104  [CAPC1608N]  (hidden comment: CAP NP)
C713  value 104  [CAPC1608N]  (hidden comment: CAP NP)
C714  value 20pF  [CAPC1608N]  (hidden comment: Cap_22p_0603)
C715  value 20pF  [CAPC1608N]  (hidden comment: Cap_22p_0603)
C716  value 104  [CAPC2012N_F]  (hidden comment: CAP NP)
C717  value 104  [CAPC2012N_F]  (hidden comment: CAP NP)
CAN  Header 2  [HDR1X2]  (value not drawn)
CAN_BUS  RJ45 socket  [RJ45]
COM  COM 9 FEMALE  [DB 9 Female]
Ethernet  RJ45 socket  [RJ45]
J71  Header 4X2  [HDR2X4]  (value not drawn)
J72  Header 4X2  [HDR2X4]  (value not drawn)
L71  value 22uH  [CAPC2012N_F]  (hidden comment: Inductor)
LAN  Header 8X2  [HDR2X8]  (value not drawn)
LED71  Blue  [LED-0805-K]  (value not drawn)
LED72  Blue  [LED-0805-K]  (value not drawn)
R71  1k  [RESC2012N_F]
R72  1k  [RESC2012N_F]
R73  value 120  [RESC2012N_F]  (hidden comment: Res_120_0805)
R74  value 10k  [RESC1608N_ZERO]  (hidden comment: Res)
R75  value 10k  [RESC1608N_ZERO]  (hidden comment: Res)
R76  value 2k2  [RESC1608N_ZERO]  (hidden comment: Res)
R77  value 49.9R  [RESC2012N_F]  (hidden comment: Res)
R78  value 49.9R  [RESC2012N_F]  (hidden comment: Res)
R79  value 49.9R  [RESC2012N_F]  (hidden comment: Res)
R710  value 49.9R  [RESC2012N_F]  (hidden comment: Res)
R711  value 560R  [RESC1608N_ZERO]  (hidden comment: Res)
R712  value 560R  [RESC1608N_ZERO]  (hidden comment: Res)
RS232  Header 4  [HDR1X4]  (value not drawn)
U71  MAX232  [SOIC127P600X175-16AN]
U72  MCP2551  [SOIC 8]
U73  ENC28J60  [SOIC-28]
XT25M  25MHz  [XT2]

### Nets
+5V: C76.2 J71.5 J71.6 J72.5 J72.6 RS232.3 U72.3(VDD)
GND: C74.1 C75.1 C76.1 C77.1 C78.1 C79.1 C710.1 C711.1 C712.1 C713.1 C714.2 C715.2 C716.1 C717.2 CAN_BUS.4 CAN_BUS.6 CAN_BUS.8 COM.5 J71.7 J71.8 J72.7 J72.8 LED71.K LED72.K R76.1 RS232.4 U71.15(GND) U72.2(VSS) U72.8(RS) U73.2(VSS) U73.11(VSSRX) U73.18(VSSTX) U73.21(VSSPLL) U73.22(VSSOSC)
VCC: C73.1 C75.2 LAN.1 U71.16(VCC)
VCC_ENC: C710.2 C711.2 C712.2 C713.2 L71.1 LAN.2 R74.2 R75.2 U73.15(VDDTX) U73.19(VDDRX) U73.20(VDDPLL) U73.25(VDDOSC) U73.28(VDD)
Vin: CAN_BUS.3 CAN_BUS.5 CAN_BUS.7
CAN_RX_PB8R: J72.4 U72.4(RXD)
CAN_TX_PB9R: J72.2 U72.1(TXD)
CANH: C77.2 CAN.1 CAN_BUS.2 R73.1 U72.7(CANH)
CANL: C78.2 CAN.2 CAN_BUS.1 R73.2 U72.6(CANL)
COM1_RX: COM.2 R71.2 RS232.1
COM1_TX: COM.3 R72.2 RS232.2
ENC_CLK: LAN.4 U73.3(CLKOUT)
ENC_CS: LAN.16 R75.1 U73.9(#CS)
ENC_INT: LAN.6 U73.4(#INT)
ENC_MISO: LAN.10 U73.6(MISO)
ENC_MOSI: LAN.12 U73.7(MOSI)
ENC_RST: R74.1 U73.10(#RESET)
ENC_SCK: LAN.14 U73.8(SCK)
LEDA: R711.1 U73.27(LEDA)
LEDB: R712.1 U73.26(LEDB)
OSC25_1: C714.1 U73.23(OSC1) XT25M.2
OSC25_2: C715.1 U73.24(OSC2) XT25M.1
PA9: J71.3
PA10: J71.1
PB0: LAN.15
PB1: LAN.7
PB8: J72.3
PB9: J72.1
PB10: LAN.5
PB11: LAN.3
PB13: LAN.11
PB14: LAN.13
PB15: LAN.9
TPIN+: Ethernet.7 R77.2 U73.13(TPIN+)
TPIN-: Ethernet.8 R78.2 U73.12(TPIN-)
TPOUT+: Ethernet.1 R79.1 U73.17(TPOUT+)
TPOUT-: Ethernet.2 R710.1 U73.16(TPOUT-)
USART1_RX_PA10: J71.2 U71.13(R1IN/MCU_RX)
USART1_TX_PA9: J71.4 U71.14(T1~{OUT}/MCU_TX)
WOL: LAN.8 U73.5(#WOL)
NetC71_1: C71.1 U71.1(C1+)
NetC71_2: C71.2 U71.3(C1-)
NetC72_1: C72.1 U71.5(C2-)
NetC72_2: C72.2 U71.4(C2+)
NetC73_2: C73.2 U71.2(VS+)
NetC74_2: C74.2 U71.6(VS-)
NetC79_2: C79.2 U73.1(VCAP)
NetC716_2: C716.2 Ethernet.6 R77.1 R78.1
NetC717_1: C717.1 Ethernet.3 L71.2 R79.2 R710.2
NetLED71_A: LED71.A R711.2
NetLED72_A: LED72.A R712.2
NetR71_1: R71.1 U71.12(R1~{OUT})
NetR72_1: R72.1 U71.11(T1IN)
NetR76_2: R76.2 U73.14(RBIAS)

Not connected (* = marked no-connect by the designer): COM 1 4 6 7 8 9 10(MH1) 11(MH2); Ethernet 4 5; U71 7(T2~{OUT}) 8(R2IN) 9(R2~{OUT}) 10(T2IN); U72 5(VREF)

### Notes on the sheet
- RS232

### Library data of the parts
C71-C78 C714 C715 = CAP NP
CAN = Header 2: Header, 2-Pin; LatestRevisionDate: 17-Jul-2002; LatestRevisionNote: Re-released for DXP Platform.; Publisher: Altium Limited
CAN_BUS Ethernet = Header 8: Header, 8-Pin; LatestRevisionDate: 17-Jul-2002; LatestRevisionNote: Re-released for DXP Platform.; Publisher: Altium Limited
COM = COM9M: PackageDocument: O; Positions: 9; Gender: Receptacle; Value: COM 9; Published: 15-Jun-2001; LatestRevisionDate: 17-Jul-2002; LatestRevisionNote: Re-released for DXP Platform.; DatasheetDocument: 1-Sep-1999; PackageReference: 788750; Publisher: Altium Limited; Orientation: Right Angle
J71 J72 = Header 4X2: Header, 4-Pin, Dual row; LatestRevisionDate: 17-Jul-2002; LatestRevisionNote: Re-released for DXP Platform.; Publisher: Altium Limited
LAN = Header 8X2: Header, 8-Pin, Dual row; LatestRevisionDate: 17-Jul-2002; LatestRevisionNote: Re-released for DXP Platform.; Publisher: Altium Limited
LED71 LED72 = LED_SMD_Blue_0805_100mcd: as LED31 on sheet [03] LCD; Package / Case: 0805; Value: Blue; Color: Blue
R71 R72 = Res: Tro dan 1k; Value: 1k
R73 = Res
RS232 = Header 4: Header, 4-Pin; LatestRevisionDate: 17-Jul-2002; LatestRevisionNote: Re-released for DXP Platform.; Publisher: Altium Limited
XT25M = Crystal

## Sheet [00] Power.SchDoc
size A
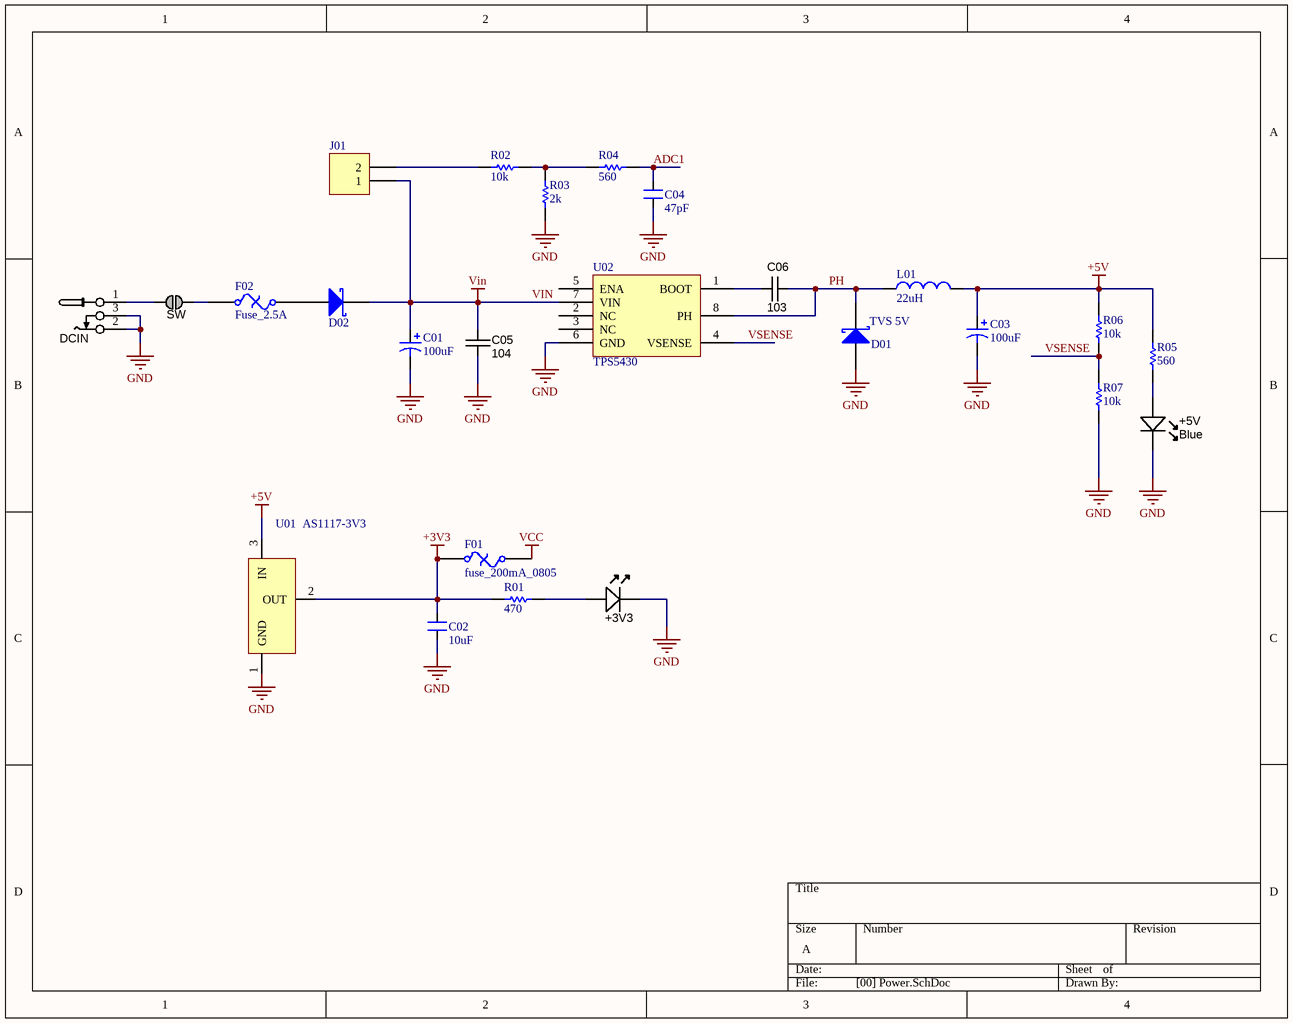
[diagram p8: [00] Power.SchDoc]

### Parts
+3V3  Blue  [LED-0805-K]  (value not drawn)
+5V  Blue  [LED-0805-K]
C01  value 100uF  [CAPE3.5-5.0MM_Rad_10x14mm]  (hidden comment: Cap)
C02  value 10uF  [CAPMP3528X210N]  (hidden comment: Cap_10uF)
C03  value 100uF  [CAPE3.5-5.0MM_Rad_10x14mm]  (hidden comment: Cap)
C04  value 47pF  [CAPC1608N]  (hidden comment: Cap_103_0603)
C05  value 104  [CAPC1608N]  (hidden comment: approved sub OK)
C06  value 103  [CAPC1608N]  (hidden comment: approved sub OK)
D01  TVS 5V  [SMD diode]
D02  SS14  [DO-214AC]  (value not drawn)
DCIN  CONN_PWR_JACK_2.1x5.5mm  [CONN_PWR_JACK_2.1x5.5mm]  (value not drawn)
F01  fuse_200mA_0805  [SMD 1206]
F02  Fuse_2.5A  [FUSE_SR-5-BK]
J01  Header 2  [HDR1X2]  (value not drawn)
L01  value 22uH  [Inductor 12x12x6]  (hidden comment: Inductor)
R01  value 470  [RESC1608N_F]  (hidden comment: Res_560_0603)
R02  value 10k  [RESC1608N_F]  (hidden comment: Res_10k_0603)
R03  value 2k  [RESC1608N_F]  (hidden comment: Res_2k_0603)
R04  value 560  [RESC1608N_F]  (hidden comment: Res_560_0603)
R05  value 560  [RESC1608N_ZERO]  (hidden comment: Res)
R06  value 10k  [RESC1608N_ZERO]  (hidden comment: Res)
R07  value 10k  [RESC1608N_ZERO]  (hidden comment: Res)
SW  Jumper  [JUMP1]  (value not drawn)  (no BOM)
U01  AS1117-3V3  [SOT223-4N]
U02  TPS5430  [SOIC127P600X175-8AN]

### Nets
+3V3: C02.2 F01.1 R01.2 U01.2(OUT)
+5V: C03.1 L01.2 R05.2 R06.2 U01.3(IN)
GND: +3V3.K +5V.K C01.2 C02.1 C03.2 C04.1 C05.2 D01.1(A) DCIN.2 DCIN.3 R03.1 R07.1 U01.1(GND) U02.6(GND)
VCC: F01.2
Vin: C01.1 C05.1 D02.2(K) J01.1 U02.7(VIN)
ADC1: C04.2 R04.1
PH: C06.2 D01.2(K) L01.1 U02.8(PH)
VSENSE: R06.1 R07.2 U02.4(VSENSE)
Net+3V3_A: +3V3.A R01.1
Net+5V_A: +5V.A R05.1
NetC06_1: C06.1 U02.1(BOOT)
NetD02_1: D02.1(A) F02.1
NetDCIN_1: DCIN.1 SW.2
NetF02_2: F02.2 SW.1
NetJ01_2: J01.2 R02.2
NetR02_1: R02.1 R03.2 R04.2

Not connected (* = marked no-connect by the designer): U02 2(NC) 3(NC) 5(ENA)

### Library data of the parts
+3V3 +5V = LED_SMD_Blue_0805_100mcd: LED 0805 SMD Blue 100mcd 470nm; Manufacturer 1: Ligitek; Manufacturer Part Number 1: LG-170DBKZ-CT; Ratings: 100 mcd; 470 nm; Package / Case: 0805; Material: InGaN/GaN; Value: Blue; Color: Blue
C02 C04 = CAP NP
C05 C06 = CAPC_1n_0603_100V: as C51 on sheet [05] RTCvsMMC; Package / Case: 0603 (1608 metric); Tolerance: ±10%; Supplier 1: Digi-Key; Supplier Part Number 1: 490-4780-1-ND; Operating Temperature: -55°C ~ 125°C; Size / Dimension: 0.063" L x 0.031" W (1.60mm x 0.80mm); Thickness (Max): 0.035" (0.90mm); ComponentLink1URL: http://search.murata.co.jp/Ceramy/image/img/PDF/ENG/GCM188R72A102KA37.pdf; ComponentLink1Description: http://search.murata.co.jp/Ceramy/image/img/PDF/ENG/GCM188R72A102KA37.pdf
D01 D02 = Diode: pin to pad: 1>A 2>K
DCIN = CONN_PWR_JACK_2.1x5.5mm: Power Connector, THT, 2.1mm ID, 5.5mm OD; Manufacturer 1: CUI Inc; Manufacturer Part Number 1: PJ-102AH; Category: Connectors; Mounting Type: Through Hole; Package / Case: PCB mount; Value: 2.1mm ID, 5.5mm OD; Supplier 1: Digi-Key; Supplier Part Number 1: CP-102AH-ND
F01 F02 = Fuse Thermal: Thermal Fuse; Published: 24-Mar-1999; LatestRevisionDate: 17-Jul-2002; LatestRevisionNote: Re-released for DXP Platform.; PackageReference: PIN-W2/E2.8; Publisher: Altium Limited; PackageDescription: Thru-Hole; 2 Leads
J01 = Header 2: Header, 2-Pin; LatestRevisionDate: 17-Jul-2002; LatestRevisionNote: Re-released for DXP Platform.; Publisher: Altium Limited
R01 R02 R03 R04 = Res
SW = JUMP1: SMD jumper
U01 = AS1117: pin to pad: 2>2+4

## Nets that join several sheets
+5V: [02] Amplier (D21.2 PWM.2), [03] LCD (7 pins), [05] RTCvsMMC (I2C.1), [06] Output (C62.1 C67.1 U61.6 U62.6), [07] Communication (7 pins), [00] Power (5 pins)
GND: [01] MCU (21 pins), [02] Amplier (11 pins), [03] LCD (13 pins), [04] Input (C41.1 C42.1 TAMP.2 WKUP.2), [05] RTCvsMMC (24 pins), [06] Output (Ferrite_bead.1 R6.1), [07] Communication (34 pins), [00] Power (14 pins)
VCC: [01] MCU (14 pins), [02] Amplier (C22.2 R21.2 U2.8 VR21.3), [04] Input (R41.2 R42.2), [05] RTCvsMMC (SDcard.1), [07] Communication (C73.1 C75.2 LAN.1 U71.16), [00] Power (F01.2)
Vin: [07] Communication (CAN_BUS.3 CAN_BUS.5 CAN_BUS.7), [00] Power (5 pins)
ADC1: [01] MCU (J13.14 U1.16), [00] Power (C04.2 R04.1)
PA1: [01] MCU (U1.15), [02] Amplier (J21.1 J21.2 J21.3)
PA4: [01] MCU (J13.12 U1.20), [06] Output (J61.3)
PA5: [01] MCU (J13.11 U1.21), [06] Output (J61.1)
PA8: [01] MCU (J12.9 U1.41), [03] LCD (J33.5)
PA9: [01] MCU (J12.10 U1.42), [07] Communication (J71.3)
PA10: [01] MCU (J12.11 U1.43), [07] Communication (J71.1)
PA11: [01] MCU (J12.12 U1.44), [03] LCD (J33.3)
PA12: [01] MCU (J12.13 U1.45), [03] LCD (J33.1)
PB0: [01] MCU (J13.6 U1.26), [03] LCD (J31.15), [07] Communication (LAN.15)
PB1: [01] MCU (J13.5 U1.27), [03] LCD (J31.13), [07] Communication (LAN.7)
PB6: [01] MCU (J11.6 U1.58), [05] RTCvsMMC (I2C.5)
PB7: [01] MCU (J11.5 U1.59), [05] RTCvsMMC (I2C.7)
PB8: [01] MCU (J11.4 U1.61), [07] Communication (J72.3)
PB9: [01] MCU (J11.3 U1.62), [07] Communication (J72.1)
PB10: [01] MCU (J13.4 U1.29), [03] LCD (J31.11), [07] Communication (LAN.5)
PB11: [01] MCU (J13.3 U1.30), [03] LCD (J31.9), [07] Communication (LAN.3)
PB12: [01] MCU (J12.1 U1.33), [03] LCD (J31.7), [05] RTCvsMMC (SDcard.3)
PB13: [01] MCU (J12.2 U1.34), [03] LCD (J31.5), [05] RTCvsMMC (SDcard.5), [07] Communication (LAN.11)
PB14: [01] MCU (J12.3 U1.35), [03] LCD (J31.3), [05] RTCvsMMC (SDcard.7), [07] Communication (LAN.13)
PB15: [01] MCU (J12.4 U1.36), [03] LCD (J31.1), [05] RTCvsMMC (SDcard.9), [07] Communication (LAN.9)
PC0: [01] MCU (J12.17 U1.8), [03] LCD (LCD_CON.11)
PC1: [01] MCU (J12.16 U1.9), [03] LCD (LCD_CON.12)
PC2: [01] MCU (J12.15 U1.10), [03] LCD (LCD_CON.13)
PC3: [01] MCU (J12.14 U1.11), [03] LCD (LCD_CON.14)
PC6: [01] MCU (J12.5 U1.37), [03] LCD (J34.2)
PC7: [01] MCU (J12.6 U1.38), [03] LCD (J34.4)
PC8: [01] MCU (J12.7 U1.39), [03] LCD (J34.6)
PC9: [01] MCU (J12.8 U1.40), [03] LCD (J34.8)
PC10: [01] MCU (J11.13 U1.51), [03] LCD (LCD_CON.6)
PC11: [01] MCU (J11.12 U1.52), [03] LCD (LCD_CON.5)
PC12: [01] MCU (J11.11 U1.53), [03] LCD (LCD_CON.4)
TAMP_PC13: [01] MCU (U1.2), [04] Input (C42.2 R42.1 TAMP.1)
WKUP_PA0: [01] MCU (U1.14), [04] Input (C41.2 R41.1 WKUP.1)